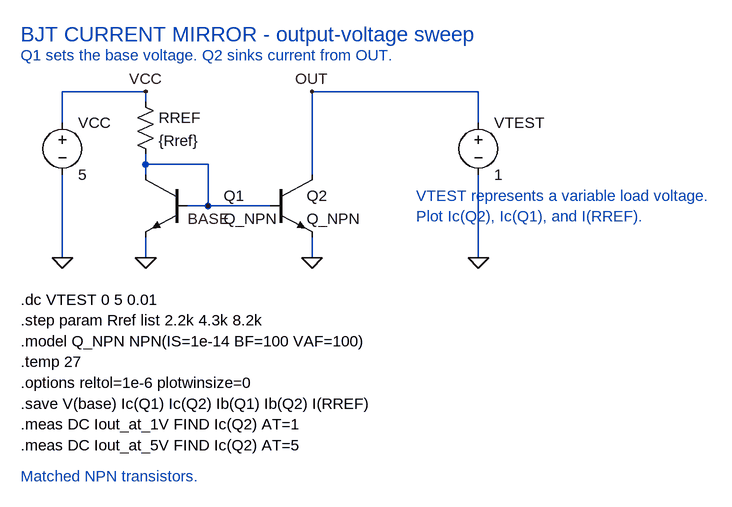
[diagram p0: schematic bjt-current-mirror.asc]
bjt-current-mirror.asc, the LTspice schematic file:
Version 4
SHEET 1 1120 760
WIRE 128 112 256 112
WIRE 128 160 128 112
WIRE 256 128 256 112
WIRE 256 224 256 208
WIRE 256 240 256 224
WIRE 352 224 256 224
WIRE 352 288 352 224
WIRE 352 288 320 288
WIRE 448 288 352 288
WIRE 512 240 512 112
WIRE 768 112 512 112
WIRE 768 160 768 112
WIRE 128 368 128 240
WIRE 256 368 256 336
WIRE 512 368 512 336
WIRE 768 368 768 240
FLAG 128 368 0
FLAG 256 368 0
FLAG 512 368 0
FLAG 768 368 0
FLAG 256 112 VCC
FLAG 352 288 BASE
FLAG 512 112 OUT
SYMBOL voltage 128 144 R0
SYMATTR InstName VCC
SYMATTR Value 5
SYMBOL res 240 112 R0
SYMATTR InstName RREF
SYMATTR Value {Rref}
SYMBOL npn 320 240 M0
WINDOW 0 -56 32 Right 2
WINDOW 3 -56 68 Right 2
SYMATTR InstName Q1
SYMATTR Value Q_NPN
SYMBOL npn 448 240 R0
SYMATTR InstName Q2
SYMATTR Value Q_NPN
SYMBOL voltage 768 144 R0
SYMATTR InstName VTEST
SYMATTR Value 1
TEXT 64 24 Left 3 ;BJT CURRENT MIRROR - output-voltage sweep
TEXT 64 56 Left 2 ;Q1 sets the base voltage. Q2 sinks current from OUT.
TEXT 672 272 Left 2 ;VTEST represents a variable load voltage.
TEXT 672 304 Left 2 ;Plot Ic(Q2), Ic(Q1), and I(RREF).
TEXT 64 432 Left 2 !.dc VTEST 0 5 0.01
TEXT 64 464 Left 2 !.step param Rref list 2.2k 4.3k 8.2k
TEXT 64 496 Left 2 !.model Q_NPN NPN(IS=1e-14 BF=100 VAF=100)
TEXT 64 528 Left 2 !.temp 27
TEXT 64 560 Left 2 !.options reltol=1e-6 plotwinsize=0
TEXT 64 592 Left 2 !.save V(base) Ic(Q1) Ic(Q2) Ib(Q1) Ib(Q2) I(RREF)
TEXT 64 624 Left 2 !.meas DC Iout_at_1V FIND Ic(Q2) AT=1
TEXT 64 656 Left 2 !.meas DC Iout_at_5V FIND Ic(Q2) AT=5
TEXT 64 704 Left 2 ;Matched NPN transistors.

The netlist it stands for:
* bjt-current-mirror.asc
VCC VCC 0 5
RREF VCC BASE {Rref}
Q1 BASE BASE 0 0 Q_NPN
Q2 OUT BASE 0 0 Q_NPN
VTEST OUT 0 1
.model NPN NPN
.model PNP PNP
.lib standard.bjt
* BJT CURRENT MIRROR - output-voltage sweep
* Q1 sets the base voltage. Q2 sinks current from OUT.
* VTEST represents a variable load voltage.
* Plot Ic(Q2), Ic(Q1), and I(RREF).
.dc VTEST 0 5 0.01
.step param Rref list 2.2k 4.3k 8.2k
.model Q_NPN NPN(IS=1e-14 BF=100 VAF=100)
.temp 27
.options reltol=1e-6 plotwinsize=0
.save V(base) Ic(Q1) Ic(Q2) Ib(Q1) Ib(Q2) I(RREF)
.meas DC Iout_at_1V FIND Ic(Q2) AT=1
.meas DC Iout_at_5V FIND Ic(Q2) AT=5
* Matched NPN transistors.
.backanno
.end